# EAGLE design RGBBlinkyCR2032 (EAGLE 7.5.0)
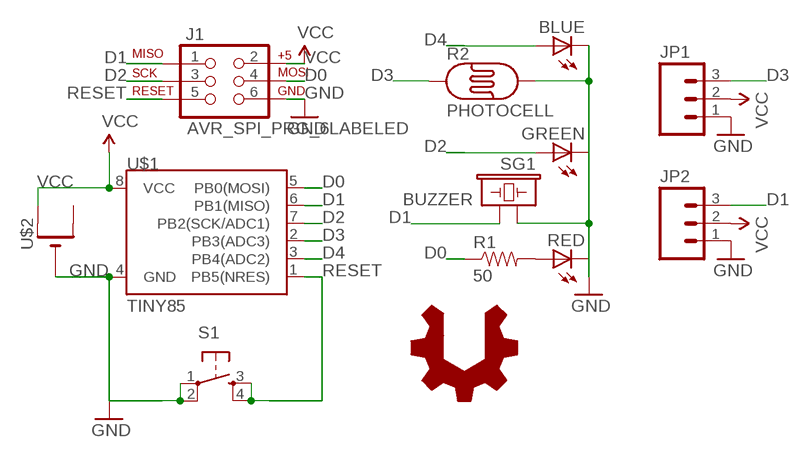
[diagram p0: schematic, sheet 1]

## Parts
BLUE  LED5MM  [LED5MM]
GREEN  LED5MM  [LED5MM]
J1  AVR_SPI_PRG_6LABELED  [2X3-NS]
JP1  M03PTH  [1X03]
JP2  M03PTH  [1X03]
R1  50  RESISTORAXIAL-0.3  [AXIAL-0.3]
R2  PHOTOCELL  PHOTOCELLPTH  [PHOTOCELL]
RED  LED5MM  [LED5MM]
S1  TAC_SWITCHPTH  [TACTILE-PTH]
SG1  BUZZER  BUZZERPTH  [BUZZER-12MM]
U$1  TINY85  ATTINY13DIP  [DIP08]
U$2  CR2032THM  [CR2032-THRU]
U$3  USER_HACKABLE  [USER_HACKABLE]

## Nets
D0: J1.4(MOSI) R1.P$1 U$1.5(PB0(MOSI))
D1: J1.1(MISO) JP2.3 SG1.- U$1.6(PB1(MISO))
D2: GREEN.A J1.3(SCK) U$1.7(PB2(SCK/ADC1))
D3: JP1.3 R2.1 U$1.2(PB3(ADC3))
D4: BLUE.A U$1.3(PB4(ADC2))
GND: BLUE.K(C) GREEN.K(C) J1.6(GND) JP1.1 JP2.1 R2.2 RED.K(C) S1.1 S1.2 SG1.+ U$1.4(GND) U$2.-
N$1: R1.P$2 RED.A
RESET: J1.5(RST) S1.3 S1.4 U$1.1(PB5(NRES))
VCC: J1.2(V+) JP1.2 JP2.2 U$1.8(VCC) U$2.+1(+)
Unconnected: U$2.+2(+1)

## Library data of the parts
BLUE GREEN RED = SparkFun-LED:LED: LEDs Standard schematic elements and footprints for 5mm, 3mm, 1206, and 0603 sized LEDs. 5mm - Spark Fun Electronics SKU : COM-00529 (and others)
J1 = barbary_enterprises:AVR_SPI_PRG_6: AVR ISP 6 Pin This is the reduced ISP connector for AVR programming. Common on Arduino. This footprint will take up less PCB space and can be used with a 10-pin to 6-pin adapter such as SKU: BOB-08508
JP1 JP2 = SparkFun-Connectors:M03: Header 3 Standard 3-pin 0.1" header. Use with straight break away headers (SKU : PRT-00116), right angle break away headers (PRT-00553), swiss pins (PRT-00743), machine pins (PRT-00117), and female headers (PRT-00115). Molex polarized connector foot print use with SKU : PRT-08232 with associated crimp pins and housings.
R1 = SparkFun-Resistors:RESISTOR: Resistor Basic schematic elements and footprints for 0603, 1206, and PTH resistors.
R2 = SparkFun-Sensors:PHOTOCELL: CdS photoresistor. This is a low cost way to detect light levels. Resistance decreases with more incoming light. SparkFun SKU: SEN-09088
S1 = barbary_enterprises:TAC_SWITCH: Momentary Switch Button commonly used for reset or general input. Spark Fun Electronics SKU : COM-00097 SMT- SWCH-08247
SG1 = SparkFun-Electromechanical:BUZZER: Buzzer 12mm Spark Fun Electronics SKU : Comp-Buzzer
U$1 = SparkFun-DigitalIC:ATTINY13: Atmel 8-pin 1kB flash uC
U$2 = battery:CR2032
U$3 = logo:USER_HACKABLE

## Board
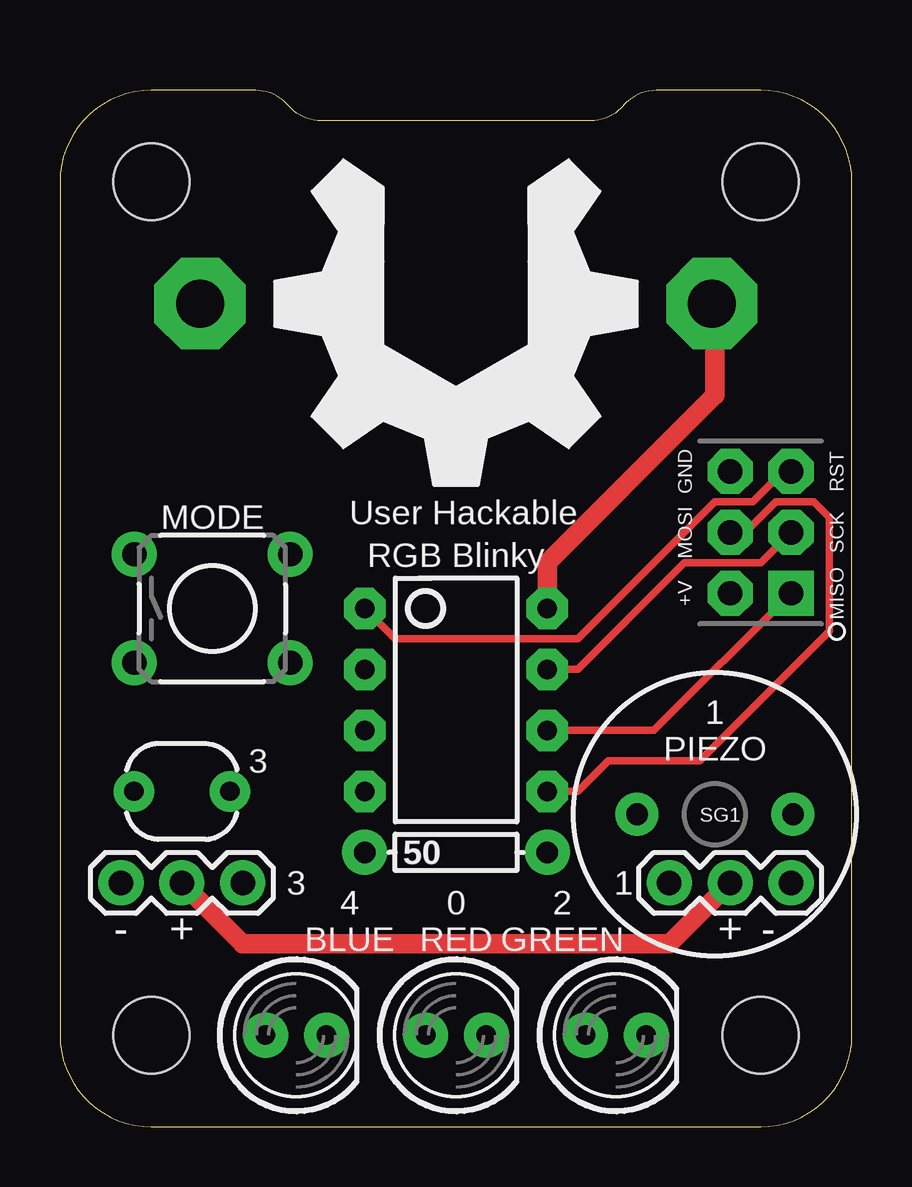
[diagram p1: board, top side]
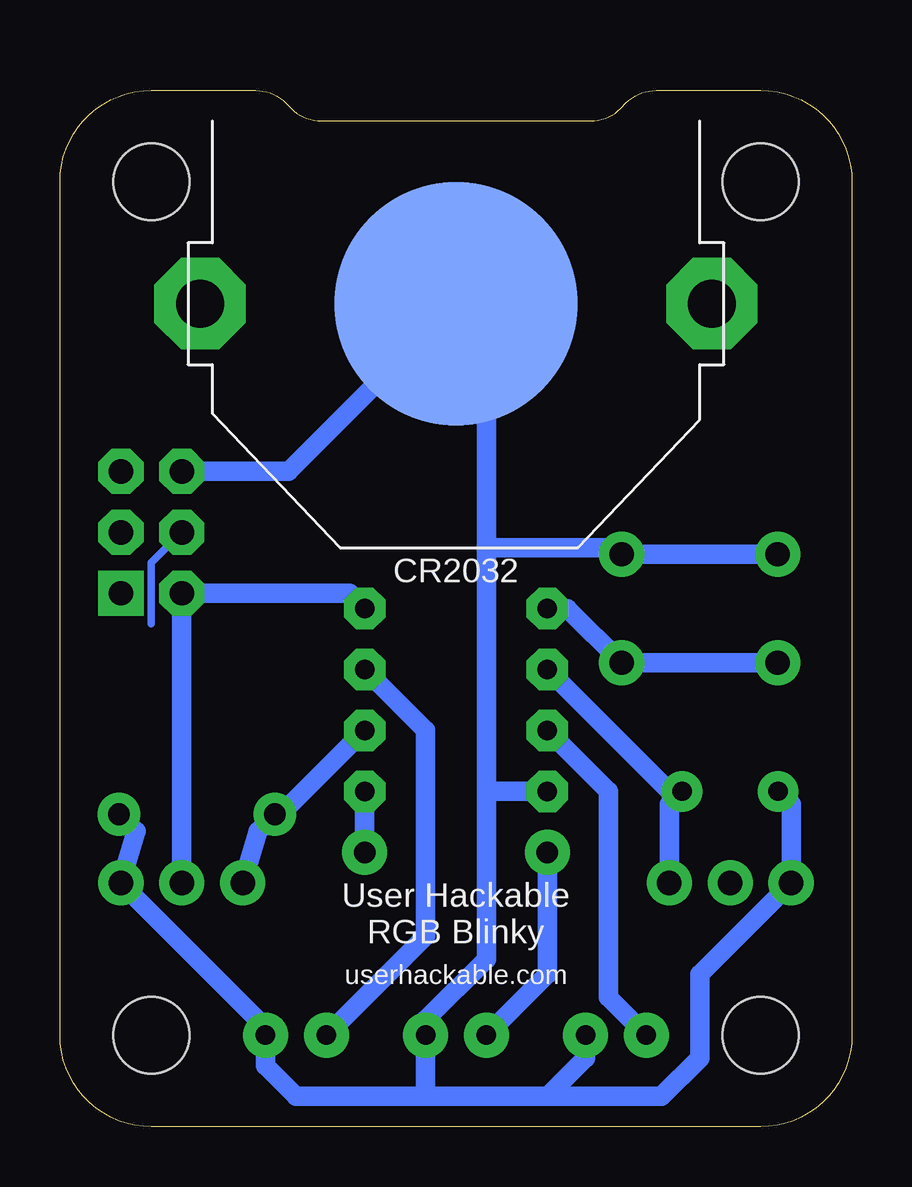
[diagram p2: board, bottom side, seen from below]

Size 33.02 x 43.18 mm. Coordinates in mm from the lower left corner, seen from the top.
Outline: 33.02,3.81 33.02,39.37 arc90 29.21,43.18 24.87,43.18 arc45 23.6,42.65 23.39,42.44 arc-45 22.12,41.91 10.9,41.91 arc-45 9.63,42.44 9.42,42.65 arc45 8.15,43.18 3.81,43.18 arc90 0,39.37 0,3.81 arc90 3.81,0 29.21,0 arc90 33.02,3.81
Copper layers (1*16): Top 0.0356mm / dielectric 1.5011mm / Bottom 0.0356mm
Design rules "LaenPCBOrder": minimum track width 6mil, minimum drill 13mil, track to track 6mil, track to pad 6mil, pad to pad 6mil, via to via 6mil, smd to smd 6mil, copper to edge 15mil, drill to drill 6mil, minimum pad ring 7mil, minimum via ring 7mil, stop-mask expansion 3mil, vias tented up to drill 0mil, thermal gap 10mil
Holes 3.17 mm at 3.81,39.37 29.21,39.37 3.81,3.81 29.21,3.81

### Footprints (pad centres in the part's own frame; a part is rotated, then mirrored left to right if it is on the bottom)
LED5MM = drill 0.813 pad 1.88: A -1.27,0; K 1.27,0
2X3-NS = drill 1.016 pad 1.88 square: 1 -2.54,-1.27 | drill 1.016 pad 1.88 octagon: 2 -2.54,1.27; 3 0,-1.27; 4 0,1.27; 5 2.54,-1.27; 6 2.54,1.27
1X03 = drill 1.016 pad 1.88: 1 0,0; 2 2.54,0; 3 5.08,0
AXIAL-0.3 = drill 0.9 pad 1.88: P$1 -3.81,0; P$2 3.81,0
PHOTOCELL = drill 0.8 pad 1.676: 1 -2,0; 2 2,0
TACTILE-PTH = drill 1.016 pad 1.88: 1 -3.251,2.261; 2 3.251,2.261; 3 -3.251,-2.261; 4 3.251,-2.261
BUZZER-12MM = drill 0.9 pad 1.778: + 3.25,0; - -3.25,0
DIP08 = drill 0.813 pad 1.727 octagon: 1 -3.81,-3.81; 2 -1.27,-3.81; 3 1.27,-3.81; 4 3.81,-3.81; 5 3.81,3.81; 6 1.27,3.81; 7 -1.27,3.81; 8 -3.81,3.81
CR2032-THRU = drill 2 pad 3.81 octagon: +1 -10.668,0; +2 10.668,0 | smd 10.16 x 10.16: - 0,0

### Placement (x,y rotation side)
BLUE  9.84,3.81 0 top
GREEN  23.18,3.81 0 top
J1  29.21,24.77 90 top
JP1  2.54,10.16 0 top
JP2  30.48,10.16 180 top
R1  16.51,11.43 180 top
R2  5.08,13.97 180 top
RED  16.51,3.81 0 top
S1  6.35,21.59 0 top
SG1  27.3,13.02 0 top
U$1  16.51,17.78 270 top
U$2  16.51,34.29 0 bottom
U$3  16.51,34.29 0 top

### Tracks (layer width: path | path; a pad name or v marks a point on that pad's centre or on a via)
D0
  Top 0.305: U$1.5 21.59,13.97 22.86,15.24 26.67,15.24 32.07,20.64 32.07,25.4 31.43,26.04 29.84,26.04 28.57,24.77 J1.4
  Bottom 0.305: J1.4 29.21,23.5 29.21,20.95
  Bottom 0.813: U$1.5 R1.P$1
D1
  Top 0.305: J1.1 24.77,16.51 U$1.6
  Bottom 0.813: JP2.3 24.77,12.31 SG1.- 23.81,13.02 U$1.6
D2
  Top 0.305: J1.3 29.21,23.5 26.04,23.5 21.59,19.05 U$1.7
  Bottom 0.813: U$1.7 17.78,16.51 17.78,7.94 GREEN.A
D3
  Bottom 0.813: U$1.2 7.62,13.97 R2.1 7.62,13.43 JP1.3
D4
  Bottom 0.813: U$1.3 10.16,13.97 10.16,5.4 BLUE.A
GND
  Bottom 0.813: J1.6 23.5,27.3 U$2.- 15.24,33.02 15.24,24.13 | 15.24,24.13 10.16,24.13 S1.2 S1.1 | 15.24,24.13 15.24,13.97 | U$1.4 15.24,13.97 | BLUE.K 11.11,2.86 12.7,1.27 | 12.7,1.27 17.78,1.27 | 17.78,1.27 23.18,1.27 24.45,2.54 GREEN.K 24.45,4.13 JP2.1 29.84,12.31 SG1.+ | 15.24,13.97 15.24,6.99 17.78,4.45 RED.K 17.78,1.27 | 12.7,1.27 7.94,1.27 6.35,2.86 6.35,6.35 JP1.1 2.54,13.43 R2.2
N$1
  Bottom 0.813: R1.P$2 12.7,6.35 RED.A
RESET
  Top 0.305: J1.5 30.16,27.3 28.89,26.04 27.3,26.04 21.59,20.32 13.97,20.32 U$1.1
  Bottom 0.813: S1.3 S1.4 11.86,21.59 U$1.1
VCC
  Top 0.813: U$2.+1 27.3,34.29 27.3,30.48 20.32,23.5 U$1.8 | JP1.2 7.62,7.62 25.4,7.62 JP2.2
  Bottom 0.813: U$1.8 20.95,22.23 J1.2 JP2.2

### Text on the board
tPlace: MODE | User Hackable | RGB Blinky | 3 | 1 / PIEZO | 3 | 1 | - | + | + | - | 4 / BLUE | 0 / RED | 2 / GREEN
bPlace: CR2032 | User Hackable / RGB Blinky | userhackable.com